# EasyEDA Pro project Power Control.eprj

# Schematic Schematic1_1
Board Name: Board1_1; Create Date: 2025-05-29; Page Name: P1; Project Name: Power Control; Schematic Name: Schematic1_1; Update Date: 2025-05-29; Company: 嘉立创EDA; Page Size: A4; Version: V1.0
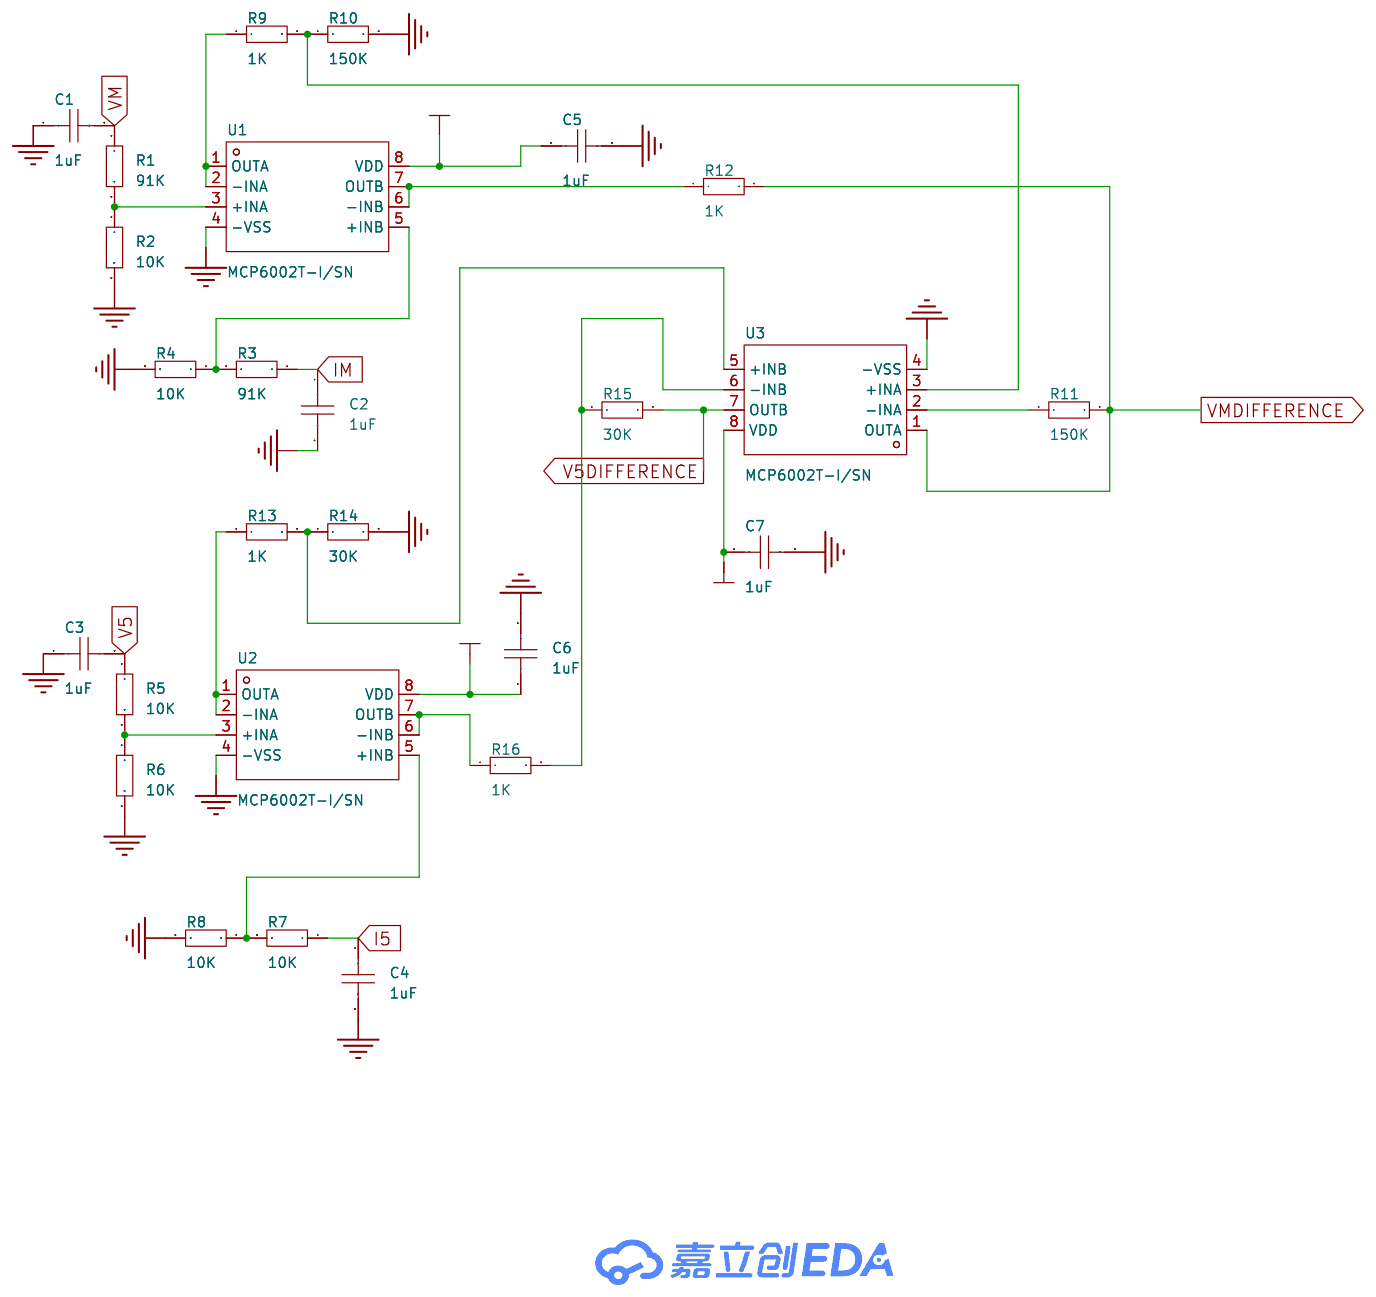
[diagram p0: schematic sheet]

## Parts
C1  1uF  [C0603]
C2  1uF  [C0603]
C3  1uF  [C0603]
C4  1uF  [C0603]
C5  1uF  [C0603]
C6  1uF  [C0603]
C7  1uF  [C0603]
R1  91K  [R0603]
R2  10K  [R0603]
R3  91K  [R0603]
R4  10K  [R0603]
R5  10K  [R0603]
R6  10K  [R0603]
R7  10K  [R0603]
R8  10K  [R0603]
R9  1K  [R0603]
R10  150K  [R0603]
R11  150K  [R0603]
R12  1K  [R0603]
R13  1K  [R0603]
R14  30K  [R0603]
R15  30K  [R0603]
R16  1K  [R0603]
U1  MCP6002T-I/SN  [SOIC-8_L4.9-W3.9-P1.27-LS6.0-BL]
U2  MCP6002T-I/SN  [SOIC-8_L4.9-W3.9-P1.27-LS6.0-BL]
U3  MCP6002T-I/SN  [SOIC-8_L4.9-W3.9-P1.27-LS6.0-BL]

## Library data of the parts
C1-C7 = CAP_0603: Supplier Footprint: 0603
R1-R16 = Res_0603: Supplier Footprint: 0603
U1-U3 = MCP6002T-I/SN: Supplier Part: C7377; Manufacturer: MICROCHIP(美国微芯); Supplier Footprint: SOIC-8; JLCPCB Part Class: 扩展库; Datasheet: https://atta.szlcsc.com/upload/public/pdf/source/20211007/C2652308_16CD27EF1CBBCC5C76CD15A9E54E0A60.pdf; Supplier: LCSC; Number of Channels: 双路; Maximum Power Supply Range (Vdd-Vss): 7V; Vos - Input Offset Voltage: 4.5mV; Input Offset Voltage Drift(Vos TC): 2uV/℃; Slew Rate: 600V/ms; Ib - Input Bias Current: 1pA; Noise density(eN): 28nV/√Hz@1kHz; Common Mode Rejection Ratio(CMRR): 76dB; Operating Temperature: -40℃~+125℃; Single supply: 1.8V~6V

## Nets
3.3V: C7.1 U3.8(VDD)
+3.3V: C5.1 C6.1 U1.8(VDD) U2.8(VDD)
GND: C1.1 C2.2 C3.1 C5.2 C6.2 C7.2 R2.2 R4.2 R6.2 R8.2 R10.2 R14.2 U1.4(-VSS) U2.4(-VSS) U3.4(-VSS)
V5: C3.2 R5.1
V5DIFFERENCE: R15.2 U3.7(OUTB)
I5: C4.1 C4.2 R7.1
IM: C2.1 R3.1
VM: C1.2 R1.1
VMDIFFERENCE: R11.2 R12.2 U3.1(OUTA)
$1N445: R9.1 U1.1(OUTA) U1.2(-INA)
$1N457: R1.2 R2.1 U1.3(+INA)
$1N864: R13.1 U2.1(OUTA) U2.2(-INA)
$1N866: R5.2 R6.1 U2.3(+INA)
$1N1342: R3.2 R4.1 U1.5(+INB)
$1N1507: R9.2 R10.1 U3.3(+INA)
$1N1684: R11.1 U3.2(-INA)
$1N1789: R12.1 U1.6(-INB) U1.7(OUTB)
$1N2620: R13.2 R14.1 U3.5(+INB)
$1N2673: R16.1 U2.6(-INB) U2.7(OUTB)
$1N2774: R7.2 R8.1 U2.5(+INB)
$1N2895: R15.1 R16.2 U3.6(-INB)

# Board PCB1_1
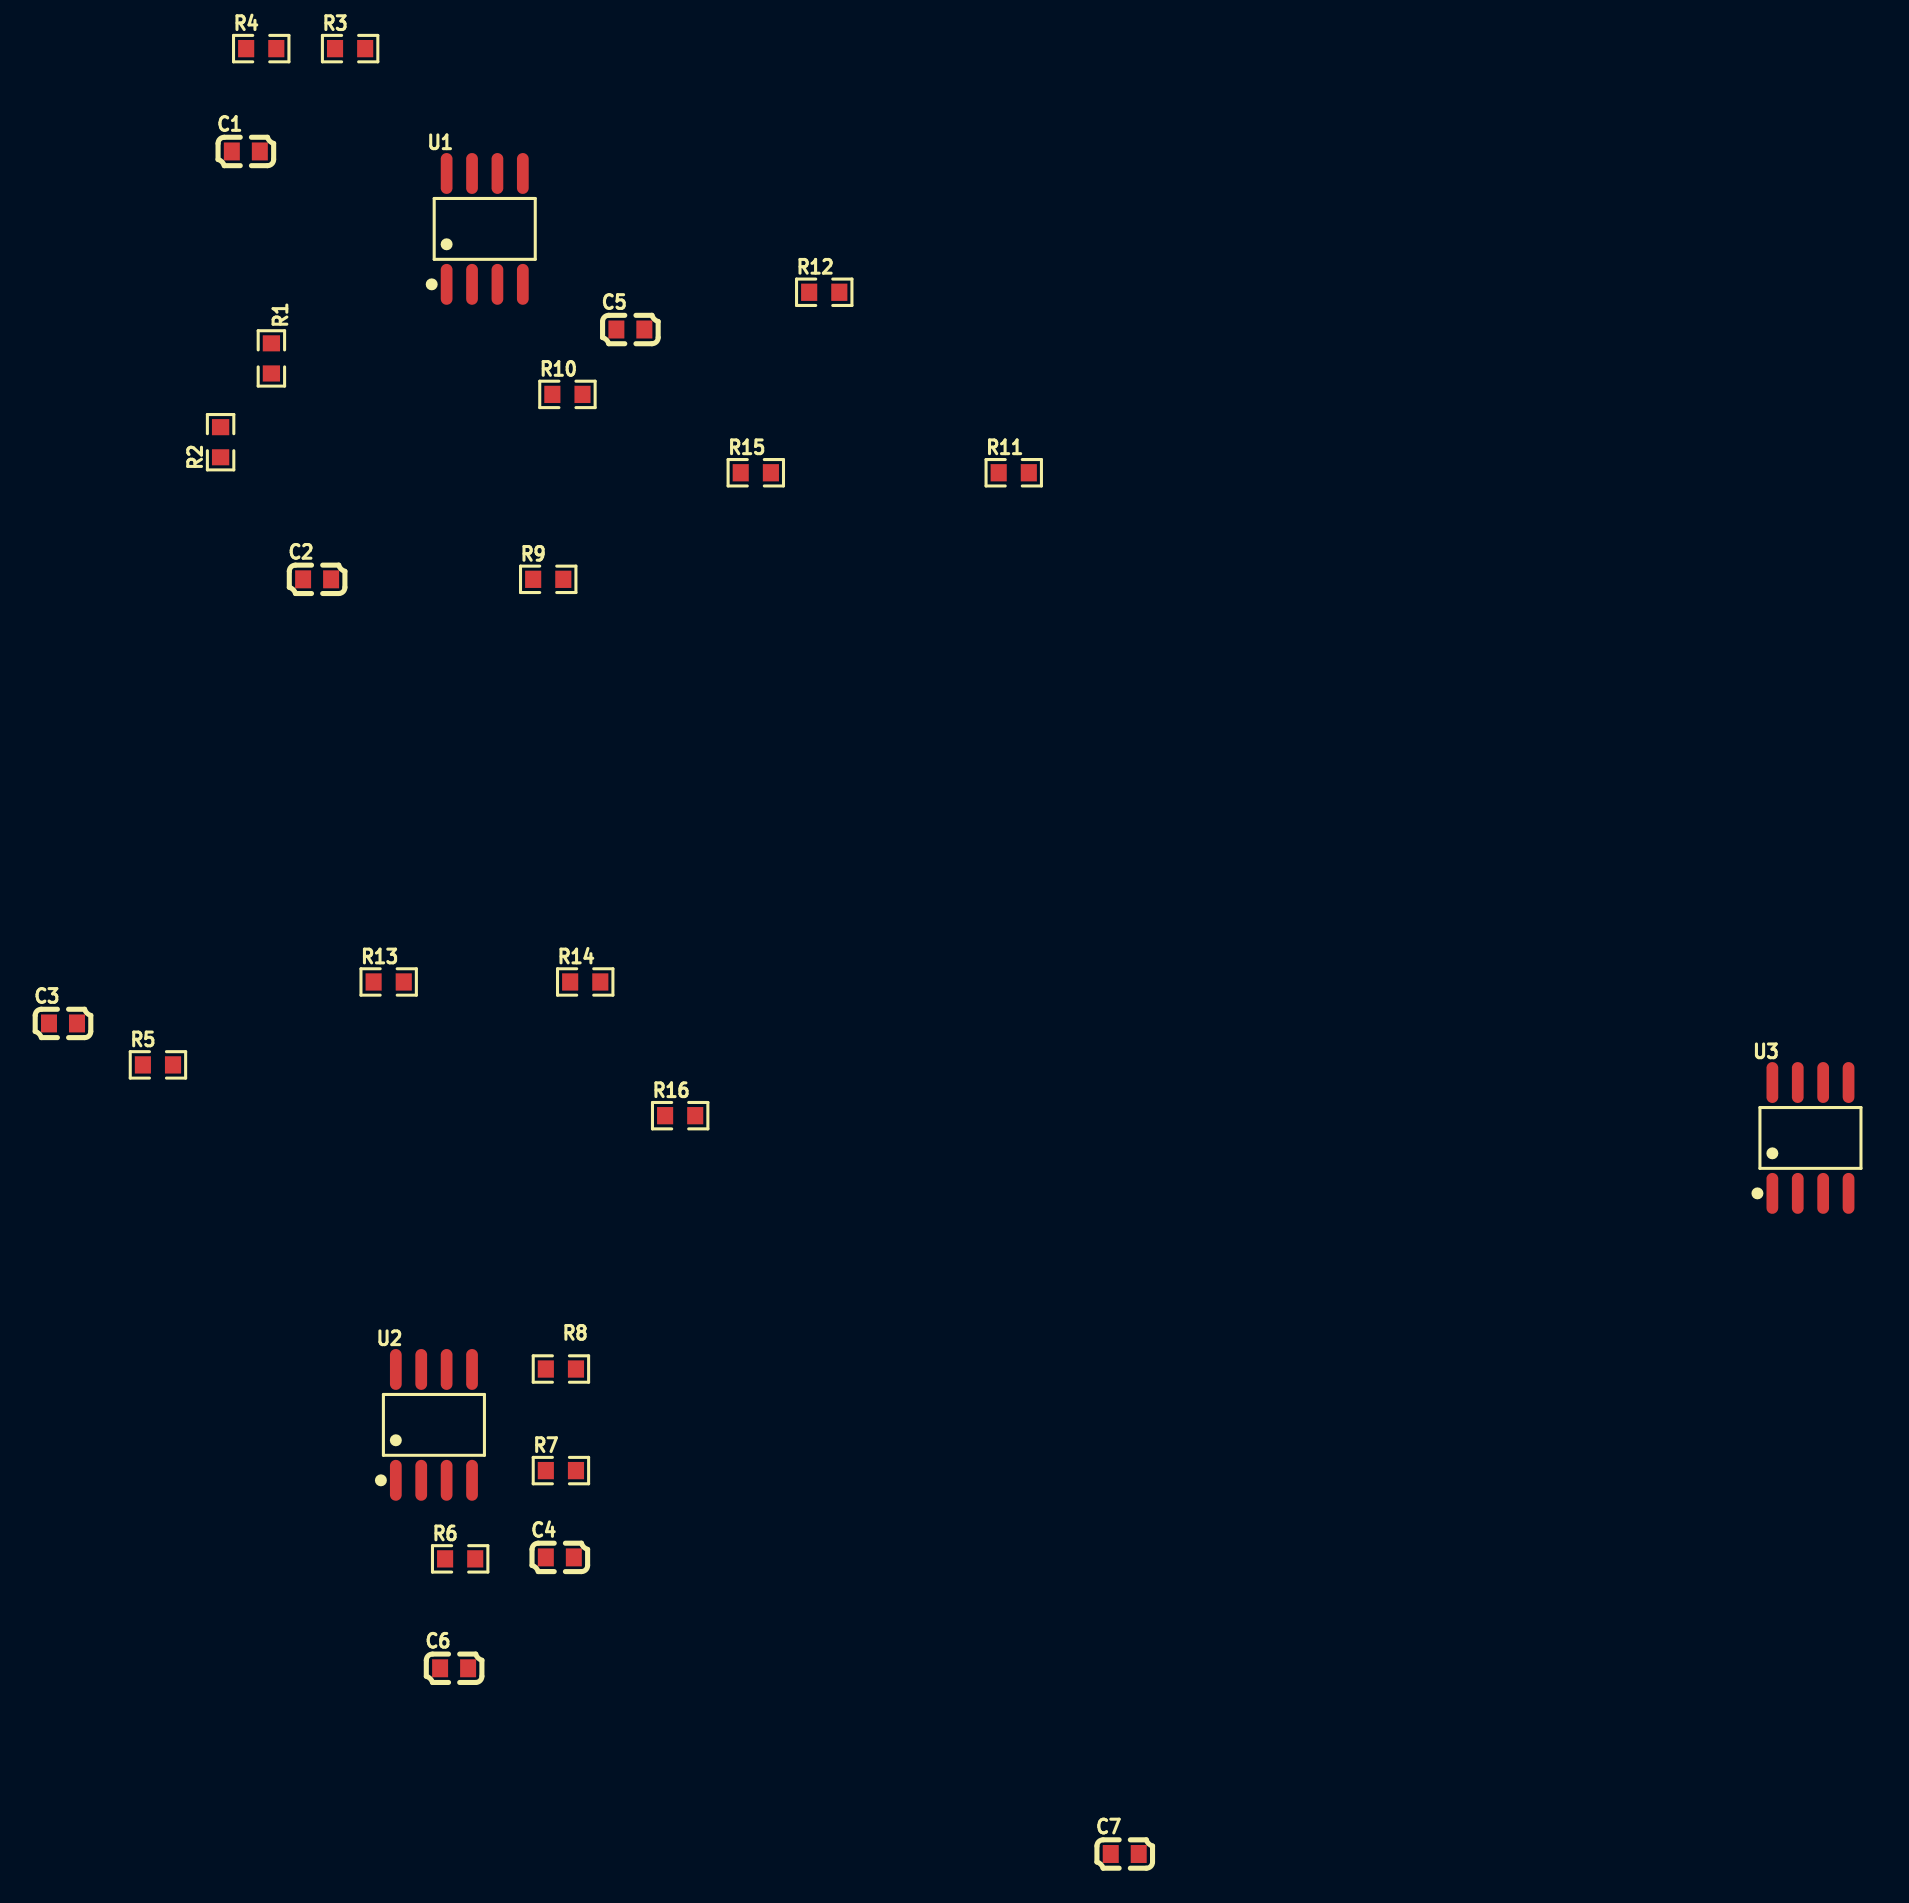
[diagram p1: board, top side]
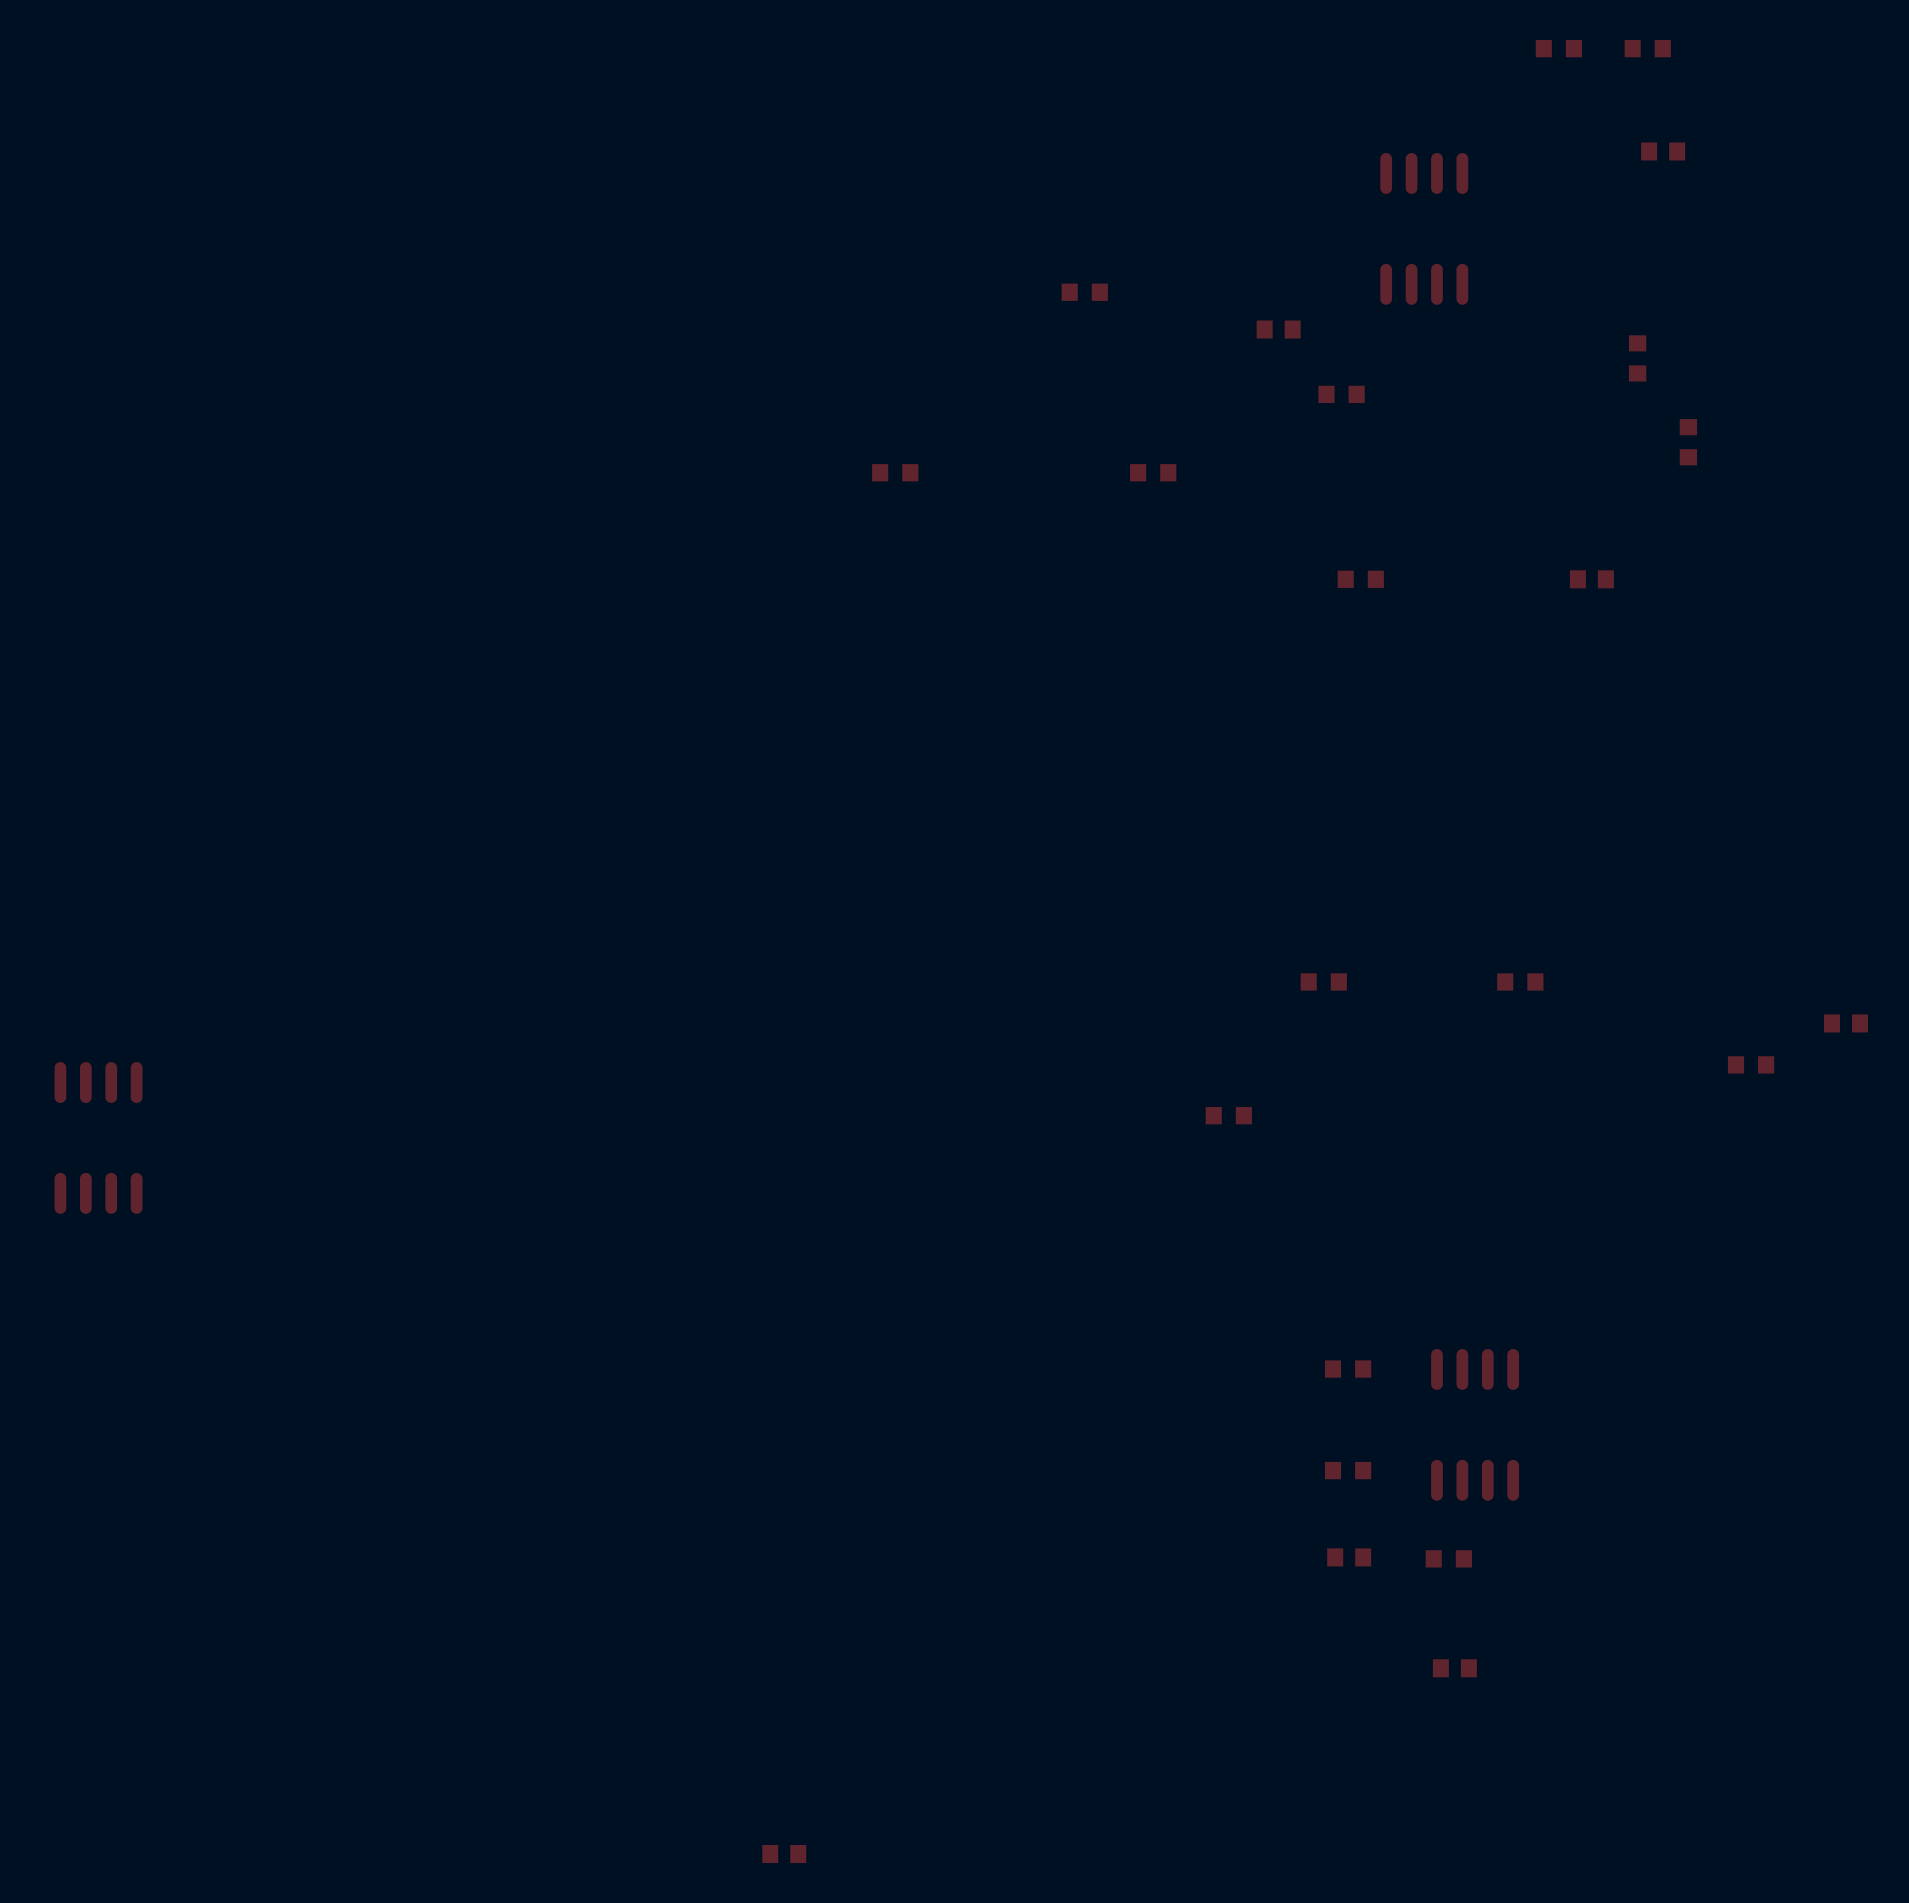
[diagram p2: board, bottom side, seen from below]

No outline. copper layers: Top Layer, Bottom Layer. Coordinates in mm from the lowest, leftmost part position.
Stack: Top Layer 0.035mm / Dielectric1 1.51mm FR4 er 4.5 / Bottom Layer 0.035mm

## Design rules (mm)
template: JLCPCB Capability(Two Layers Board)
spacing copperThickness1oz (default): track to track 0.102, other pairs 0.152 to 0.3
spacing copperThickness2oz: track to track 0.203, other pairs 0.152 to 0.3
track width copperThickness1oz (default): min 0.127, default 0.254, max 2.54
track width copperThickness2oz: min 0.203, default 0.254, max 2.54
differential pair differentialPair (default): width min 0.127, default 0.254, max 2.54; gap min 0.152, default 0.152
via viaSize (default): diameter min 0.5, default 0.61, max 10; hole min 0.3, default 0.305, max 6.3

## Placement (name value [footprint] x y rotation side)
C1  1uF  [C0603]  9.14 85.15 0 top
C2  1uF  [C0603]  12.71 63.75 0 top
C3  1uF  [C0603]  0 41.54 0 top
C4  1uF  [C0603]  24.84 14.84 0 top
C5  1uF  [C0603]  28.37 76.25 0 top
C6  1uF  [C0603]  19.56 9.29 0 top
C7  1uF  [C0603]  53.09 0 0 top
R1  91K  [R0603]  10.42 74.8 270 top
R2  10K  [R0603]  7.88 70.61 90 top
R3  91K  [R0603]  14.36 90.3 0 top
R4  10K  [R0603]  9.91 90.3 0 top
R5  10K  [R0603]  4.75 39.47 0 top
R6  10K  [R0603]  19.86 14.76 0 top
R7  10K  [R0603]  24.9 19.18 0 top
R8  10K  [R0603]  24.9 24.26 180 top
R9  1K  [R0603]  24.26 63.75 0 top
R10  150K  [R0603]  25.23 73 0 top
R11  150K  [R0603]  47.54 69.08 0 top
R12  1K  [R0603]  38.07 78.11 0 top
R13  1K  [R0603]  16.29 43.62 0 top
R14  30K  [R0603]  26.11 43.62 0 top
R15  30K  [R0603]  34.64 69.08 0 top
R16  1K  [R0603]  30.86 36.93 0 top
U1  MCP6002T-I/SN  [SOIC-8_L4.9-W3.9-P1.27-LS6.0-BL]  21.09 81.28 0 top
U2  MCP6002T-I/SN  [SOIC-8_L4.9-W3.9-P1.27-LS6.0-BL]  18.55 21.46 0 top
U3  MCP6002T-I/SN  [SOIC-8_L4.9-W3.9-P1.27-LS6.0-BL]  87.38 35.81 0 top

## Footprints (pads in the part's own frame, mm; a bottom-side part is the same pattern mirrored in y, then rotated)
C0603
  rect 0.8x0.9 smd: 1(-0.7,0) 2(0.7,0)
R0603
  rect 0.806x0.864 smd: 1(-0.753,0) 2(0.753,0)
SOIC-8_L4.9-W3.9-P1.27-LS6.0-BL
  oval 0.588x2.045 smd: 1(-1.905,-2.772) 2(-0.635,-2.772) 3(0.635,-2.772) 4(1.905,-2.772) 5(1.905,2.772) 6(0.635,2.772) 7(-0.635,2.772) 8(-1.905,2.772)

## Nets
As in the schematic.
